# EasyEDA Pro project AT32M412_EVB_V0.3.eprj, board AT32M412_EVB_V0.2
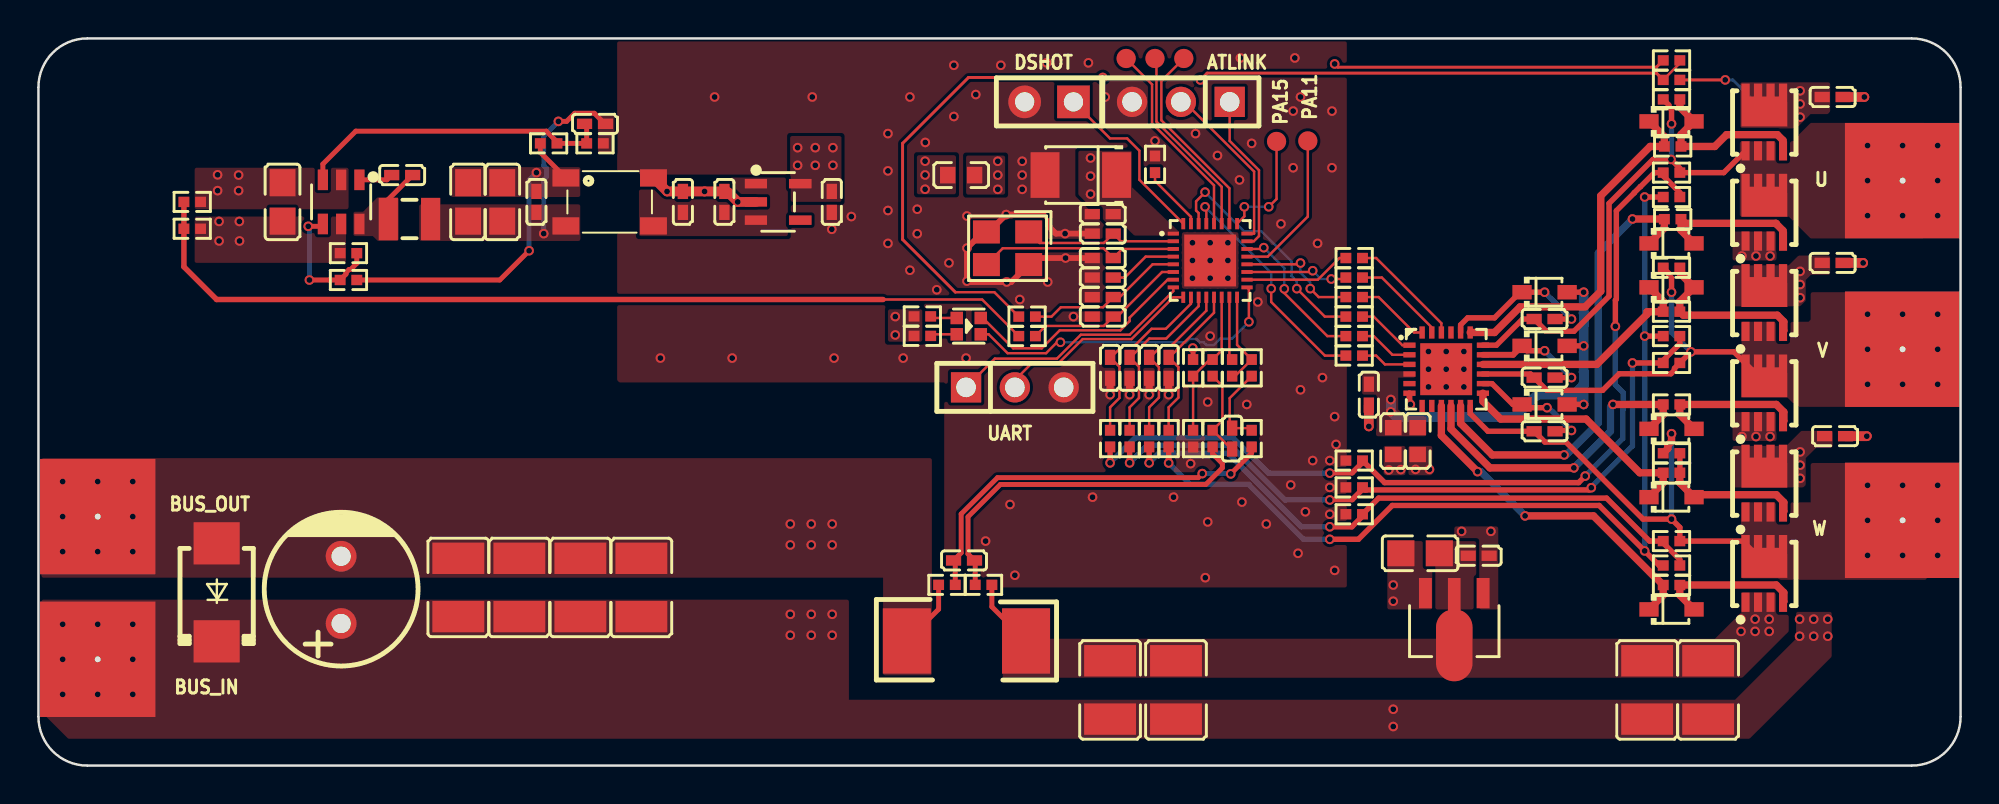
[diagram p4: board, top side]
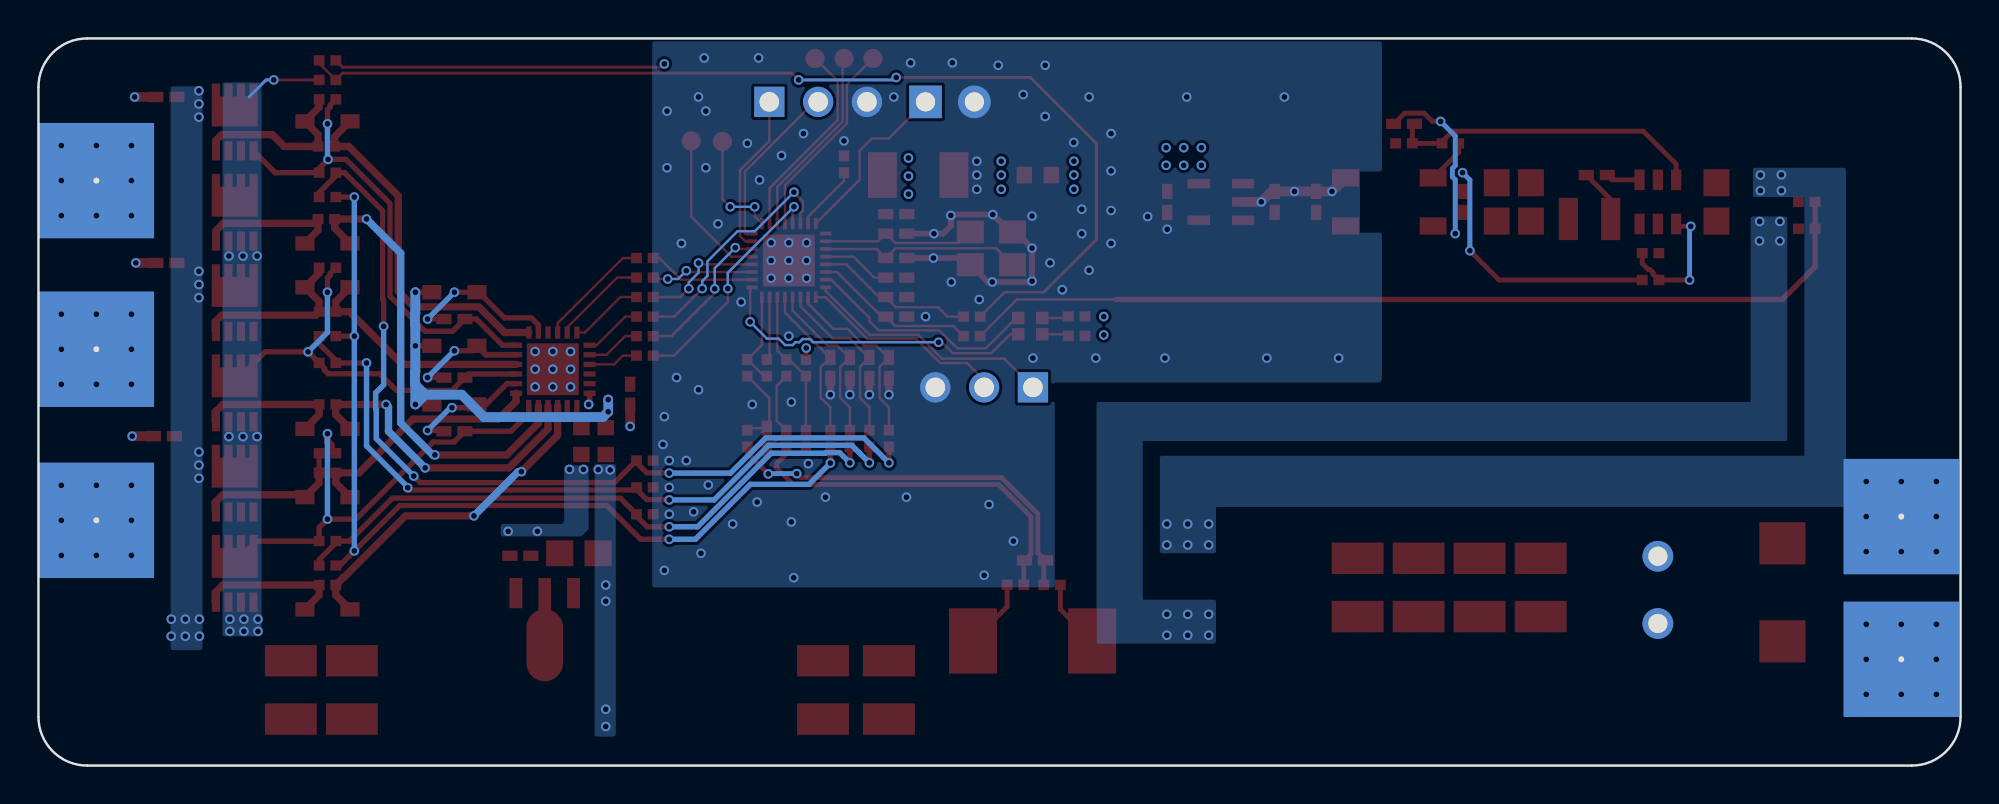
[diagram p5: board, bottom side, seen from below]

Outline 100 x 37.85 mm; copper layers: Top Layer, GND02, PWR03, Bottom Layer. Coordinates in mm from the lower left corner of the outline.
Outline path: 0,35.31 0,2.54 arc(0.74,0.74) 2.54,0 97.46,0 arc(99.26,0.74) 100,2.54 100,35.31 arc(99.26,37.1) 97.46,37.85 2.54,37.85 arc(0.74,37.1) 0,35.31
Stack: Top Layer 0.035mm 外层铜厚1oz / Dielectric1 0.2104mm 7628 RC49% 8.6mil / GND02 0.0152mm 内层铜厚 / Dielectric2 1.065mm 1.1mm H/HOZ Copper / PWR03 0.0152mm 内层铜厚 / Dielectric3 0.2104mm 7628 RC49% 8.6mil / Bottom Layer 0.035mm 外层铜厚1oz

## Design rules (mm)
template: 自定义配置
spacing copperThickness1oz (default): track to track 0.102, other pairs 0.152 to 0.3
spacing copperThickness2oz: track to track 0.203, other pairs 0.152 to 0.3
spacing edgeClearance: track to track 0.152, other pairs 0 to 0.152
track width copperThickness1oz (default): min 0.127, default 0.127, max 2.54
track width PWR: min 0.152, default 0.381, max 2.54
differential pair 90ohm (default): width min 0.152, default 0.152, max 0.152; gap min 0.178, default 0.178
via viaSize (default): diameter min 0.5, default 0.5, max 10; hole min 0.3, default 0.305, max 6.299
net GND uses PWR
net VBUS uses PWR
net GNDP uses PWR
net VCC_3V3 uses PWR
region e1533 uses edgeClearance
region e1534 uses edgeClearance
region e1535 uses edgeClearance
region e1536 uses edgeClearance
region e1537 uses edgeClearance

## Placement (name value [footprint] x y rotation side)
ATLINK  PM254V-11-03-H85  [HDR-TH_3P-P2.54-V-F]  59.44 34.54 180 top
BUS_IN  -  [PAD_35A]  4.35 5.02 180 top
BUS_OUT  -  [PAD_35A]  4.35 12.45 180 top
C131  100nF  [C0402]  55.37 28.7 0 top
C205  220uF  [CAP-TH_BD8.0-P3.50-D0.6-FD]  15.75 9.14 90 top
C208  10uF  [C0805]  12.7 29.34 270 top
C210  10uF  [C0402]  25.91 29.34 270 top
C211  100nF  [C0402]  55.37 25.4 0 top
C212  12pF  [C0402]  55.37 27.69 180 top
C213  12pF  [C0402]  55.37 26.42 0 top
C214  100nF  [C0402]  69.21 19.3 270 top
C215  100nF  [C0402]  78.36 23.24 0 top
C217  100nF  [C0402]  78.36 20.19 0 top
C219  100nF  [C0402]  78.36 17.4 0 top
C220  2.2nF  [C0402]  48.15 10.68 180 top
C221  4.7uF  [C1210]  59.18 3.94 270 top
C225  100nF  [C0402]  55.37 23.37 0 top
C226  100nF  [C0402]  55.37 24.38 0 top
C227  33pF  [C0402]  55.75 20.7 90 top
C228  33pF  [C0402]  56.77 20.7 90 top
C229  33pF  [C0402]  57.79 20.7 90 top
C230  33pF  [C0402]  58.8 20.7 90 top
C231  100pF  [C0402]  62.1 17.02 270 top
C232  100nF  [C0402]  18.92 30.73 180 top
C233  100nF  [C0402]  28.96 33.4 180 top
C234  10uF  [C0402]  33.53 29.34 270 top
C235  1uF  [C0402]  35.69 29.34 270 top
C236  1uF  [C0402]  41.27 29.34 90 top
C237  100uF  [CASE-B_3528]  54.23 30.73 180 top
C238  100nF  [C0402]  93.35 34.8 0 top
C239  100nF  [C0402]  93.35 26.16 0 top
C240  100nF  [C0402]  93.47 17.14 0 top
C241  100nF  [C0402]  74.93 10.92 180 top
C243  4.7uF  [C0805]  22.35 29.34 270 top
C244  4.7uF  [C0805]  24.13 29.34 270 top
C245  4.7uF  [C1210]  21.84 9.27 270 top
C246  4.7uF  [C1210]  25.02 9.27 270 top
C247  4.7uF  [C1210]  28.19 9.27 270 top
C248  4.7uF  [C1210]  31.37 9.27 270 top
C249  4.7uF  [C1210]  55.75 3.94 270 top
C250  4.7uF  [C1210]  83.69 3.94 270 top
C251  4.7uF  [C1210]  86.87 3.94 270 top
C252  330nF  [C0805]  71.88 11.05 180 top
D37  1N4148WS  [SOD-323_L1.8-W1.3-LS2.5-RD]  78.36 24.64 0 top
D38  1N4148WS  [SOD-323_L1.8-W1.3-LS2.5-RD]  78.36 21.84 0 top
D39  1N4148WS  [SOD-323_L1.8-W1.3-LS2.5-RD]  78.36 18.8 0 top
D40  1N4148WS  [SOD-323_L1.8-W1.3-LS2.5-RD]  84.96 33.53 0 top
D41  1N4148WS  [SOD-323_L1.8-W1.3-LS2.5-RD]  84.96 24.89 0 top
D42  1N4148WS  [SOD-323_L1.8-W1.3-LS2.5-RD]  84.96 13.97 0 top
D43  1N4148WS  [SOD-323_L1.8-W1.3-LS2.5-RD]  84.96 27.18 0 top
D44  1N4148WS  [SOD-323_L1.8-W1.3-LS2.5-RD]  84.96 17.53 0 top
D45  1N4148WS  [SOD-323_L1.8-W1.3-LS2.5-RD]  84.96 8.13 0 top
DSHOT  2.54-1*2P母  [HDR-TH_2P-P2.54-V-F]  52.58 34.54 180 top
L11  2.2uH  [IND-SMD_L2.5-W2.0_MHCHL2520]  19.3 28.45 0 top
L12  ACT45B-510-2P-TL003  [IND-SMD_4P-L4.5-W3.2-TL]  29.72 29.34 0 top
L13  BLM18AG102SN1D  [L0603]  48.01 30.73 0 top
L14  BLM18AG102SN1D  [L0603]  71.75 16.89 90 top
L15  NC  [L0603]  70.48 16.89 90 top
LDO1  ME6211C33M5G-N  [SOT-23-5_L3.0-W1.7-P0.95-LS2.8-BL]  38.48 29.34 270 top
LED1  NCD1615RG1  [LED-SMD_4P-L1.6-W1.5-TL-1]  48.4 22.87 180 top
PA11  -  [Mark-Point-1mm]  66.04 32.51 90 top
PA15  -  [Mark-Point-1mm]  64.41 32.48 90 top
PB3  -  [Mark-Point-1mm]  59.59 36.8 90 top
PB4  -  [Mark-Point-1mm]  58.09 36.8 90 top
PB5  -  [Mark-Point-1mm]  56.59 36.8 90 top
Q1  TMG60N04DF  [POWERDI3333-8_DMN7022LFGQ-7]  89.79 33.02 0 top
Q2  TMG60N04DF  [POWERDI3333-8_DMN7022LFGQ-7]  89.79 28.32 0 top
Q3  TMG60N04DF  [POWERDI3333-8_DMN7022LFGQ-7]  89.79 23.62 0 top
Q4  TMG60N04DF  [POWERDI3333-8_DMN7022LFGQ-7]  89.79 18.92 0 top
Q5  TMG60N04DF  [POWERDI3333-8_DMN7022LFGQ-7]  89.79 14.22 0 top
Q6  TMG60N04DF  [POWERDI3333-8_DMN7022LFGQ-7]  89.79 9.53 0 top
R186  124kΩ  [R0402]  28.96 32.39 180 top
R188  1kΩ  [R0402]  58.09 31.29 90 top
R189  1kΩ  [R0402]  45.99 23.38 0 top
R190  1kΩ  [R0402]  45.99 22.36 0 top
R191  10Ω  [R0402]  85.02 32.22 0 top
R192  10Ω  [R0402]  85.02 28.44 0 top
R193  10Ω  [R0402]  84.96 23.62 0 top
R194  10Ω  [R0402]  84.96 18.8 0 top
R195  10Ω  [R0402]  84.96 15.24 0 top
R196  10Ω  [R0402]  84.96 9.4 0 top
R197  10Ω  [R0402]  68.45 26.42 0 top
R198  10Ω  [R0402]  68.45 23.37 0 top
R199  10Ω  [R0402]  68.45 25.4 0 top
R200  10Ω  [R0402]  68.45 22.35 0 top
R201  10Ω  [R0402]  68.45 24.38 0 top
R202  10Ω  [R0402]  68.45 21.34 0 top
R203  2mΩ  [RES-SMD_L6.4-W3.2-1]  48.28 6.49 180 top
R204  10Ω  [R0402]  49.17 9.41 0 top
R205  10Ω  [R0402]  47.27 9.41 180 top
R206  NCP15XH103F03RC  [R0402]  84.96 35.69 180 top
R207  3kΩ  [R0402]  84.96 36.7 180 top
R208  100Ω  [R0402]  51.43 22.35 0 top
R209  100Ω  [R0402]  51.43 23.37 0 top
R211  51kΩ  [R0402]  84.96 29.59 0 top
R213  3kΩ  [R0402]  68.45 15.88 180 top
R214  43kΩ  [R0402]  84.96 30.86 0 top
R215  51kΩ  [R0402]  84.96 22.35 0 top
R216  43kΩ  [R0402]  84.96 20.95 0 top
R217  3kΩ  [R0402]  68.45 14.48 180 top
R218  51kΩ  [R0402]  84.96 10.41 0 top
R219  43kΩ  [R0402]  84.96 11.68 0 top
R220  3kΩ  [R0402]  68.45 13.08 180 top
R221  1Ω  [R0402]  55.75 17.02 90 top
R222  1Ω  [R0402]  56.77 17.02 90 top
R223  1Ω  [R0402]  57.79 17.02 90 top
R224  1Ω  [R0402]  58.8 17.02 90 top
R225  1.2kΩ  [R0402]  61.09 17.02 90 top
R226  1.2kΩ  [R0402]  63.12 17.02 90 top
R227  1.2kΩ  [R0402]  61.09 20.7 90 top
R228  1.2kΩ  [R0402]  63.12 20.7 90 top
R229  66.5kΩ  [R0402]  62.1 20.7 90 top
R230  47kΩ  [R0402]  8 27.94 180 top
R231  10kΩ  [R0402]  8 29.34 0 top
R237  133kΩ  [R0402]  60.07 20.7 270 top
R238  133kΩ  [R0402]  60.07 17.02 90 top
R239  200kΩ  [R0402]  84.96 34.67 0 top
R240  200kΩ  [R0402]  84.96 25.91 0 top
R241  200kΩ  [R0402]  84.96 16.26 0 top
R242  23.7kΩ  [R0402]  26.54 32.39 180 top
R243  12kΩ  [R0402]  16.13 26.67 0 top
R244  4.7kΩ  [R0402]  16.13 25.27 0 top
U  -  [PAD_35A]  95.72 30.95 0 top
U34  AT32M412KBU7-4  [WQFN-32_L4.0-W4.0-P0.40-TL-EP2.7]  60.96 26.29 0 top
U39  BL9342  [SOT-23-6_L2.9-W1.6-P0.95-LS2.8-BL]  15.75 29.34 180 top
U40  JSM6288Q  [VQFN-24_L4.0-W4.0-P0.50-TL-EP2.7]  73.24 20.63 0 top
U41  SMBJ18A  [SMB_L4.5-W3.6-LS5.4-RD]  9.27 9.02 90 top
U43  CJ78L12  [SOT-89-3_L4.5-W2.5-P1.50-LS4.2-BR]  73.66 7.62 90 top
UART  PM254V-11-03-H85  [HDR-TH_3P-P2.54-V-F]  50.8 19.69 0 top
V  -  [PAD_35A]  95.72 22.18 0 top
W  -  [PAD_35A]  95.72 13.27 0 top
X3  24MHz  [CRYSTAL-SMD_4P-L3.2-W2.5-BL]  50.42 26.92 180 top

## Footprints (pads in the part's own frame, mm; a bottom-side part is the same pattern mirrored in y, then rotated)
C0402
  rect 0.79x0.54 smd: 1(-0.545,0) 2(0.545,0)
C0805
  rect 1.41x1.35 smd: 1(-1,0) 2(1,0)
C1210
  rect 1.635x2.7 smd: 1(-1.518,0) 2(1.518,0)
CAP-TH_BD8.0-P3.50-D0.6-FD
  round 1.6 hole 1: 1(-1.75,0) 2(1.75,0)
CASE-B_3528
  rect 1.506x2.376 smd: 1(-1.861,0) 2(1.861,0)
CRYSTAL-SMD_4P-L3.2-W2.5-BL
  rect 1.4x1.2 smd: 1(-1.1,-0.85) 2(1.1,-0.85) 3(1.1,0.85) 4(-1.1,0.85)
HDR-TH_2P-P2.54-V-F
  rect 1.7x1.7 hole 1: 1(-1.27,0)
  round 1.7 hole 1: 2(1.27,0)
HDR-TH_3P-P2.54-V-F
  rect 1.575x1.575 hole 1.02: 1(-2.54,0)
  round 1.575 hole 1.02: 2(0,0) 3(2.54,0)
IND-SMD_4P-L4.5-W3.2-TL
  rect 1.4x0.9 smd: 1(-2.28,1.25) 2(-2.28,-1.25) 3(2.28,-1.25) 4(2.28,1.25)
IND-SMD_L2.5-W2.0_MHCHL2520
  rect 1x2.2 smd: 1(-1.1,0) 2(1.1,0)
L0603
  rect 0.8x0.864 smd: 1(-0.7,0) 2(0.7,0)
LED-SMD_4P-L1.6-W1.5-TL-1
  rect 0.65x0.65 smd: 1(-0.625,0.425) 2(0.625,0.425) 3(-0.625,-0.425) 4(0.625,-0.425)
Mark-Point-1mm
  round 1 smd: 1(0,0)
PAD_35A
  rect 6x6 hole 0.305: 1(1.27,-0.508)
POWERDI3333-8_DMN7022LFGQ-7
  rect 0.42x1 smd: 1(-0.975,-1.025) 2(-0.325,-1.025) 3(0.325,-1.025) 4(0.975,-1.025)
  custom 2.39x2.23 smd: 5(0.005,1.025)
R0402
  rect 0.566x0.54 smd: 1(-0.433,0) 2(0.433,0)
RES-SMD_L6.4-W3.2-1
  rect 2.5x3.4 smd: 1(-3.1,0) 2(3.1,0)
SMB_L4.5-W3.6-LS5.4-RD
  rect 2.2x2.4 smd: 1(-2.551,0) 2(2.551,0)
SOD-323_L1.8-W1.3-LS2.5-RD
  rect 1x0.75 smd: 1(-1.173,0) 2(1.173,0)
SOT-23-5_L3.0-W1.7-P0.95-LS2.8-BL
  rect 0.49x1.157 smd: 1(-0.95,-1.153) 2(0,-1.153) 3(0.95,-1.153)
  rect 0.49x1.175 smd: 4(0.95,1.153) 5(-0.95,1.153)
SOT-23-6_L2.9-W1.6-P0.95-LS2.8-BL
  rect 0.532x1.072 smd: 1(-0.95,-1.149) 2(0,-1.149) 3(0.95,-1.149) 4(0.95,1.149) 5(0,1.149) 6(-0.95,1.149)
SOT-89-3_L4.5-W2.5-P1.50-LS4.2-BR
  rect 1.575x0.672 smd: 1(1.356,-1.5) 3(1.356,1.5)
  custom 5.377x1.9 smd: 2(-1.356,0)
VQFN-24_L4.0-W4.0-P0.50-TL-EP2.7
  rect 0.633x0.28 smd: 1(-1.911,1.25) 2(-1.911,0.75) 3(-1.911,0.25) 4(-1.911,-0.25) 5(-1.911,-0.75) 6(-1.911,-1.25) 13(1.911,-1.25) 14(1.911,-0.75) 15(1.911,-0.25) 16(1.911,0.25) 17(1.911,0.75) 18(1.911,1.25)
  rect 0.28x0.633 smd: 7(-1.25,-1.911) 8(-0.75,-1.911) 9(-0.25,-1.911) 10(0.25,-1.911) 11(0.75,-1.911) 12(1.25,-1.911) 19(1.25,1.911) 20(0.75,1.911) 21(0.25,1.911) 22(-0.25,1.911) 23(-0.75,1.911) 24(-1.25,1.911)
  rect 2.7x2.7 smd: 25(0,0)
WQFN-32_L4.0-W4.0-P0.40-TL-EP2.7
  rect 0.585x0.2 smd: 1(-1.917,1.4) 2(-1.917,1) 3(-1.917,0.6) 4(-1.917,0.2) 5(-1.917,-0.2) 6(-1.917,-0.6) 7(-1.917,-1) 8(-1.917,-1.4) 17(1.917,-1.4) 18(1.917,-1) 19(1.917,-0.6) 20(1.917,-0.2) 21(1.917,0.2) 22(1.917,0.6) 23(1.917,1) 24(1.917,1.4)
  rect 0.2x0.585 smd: 9(-1.4,-1.917) 10(-1,-1.917) 11(-0.6,-1.917) 12(-0.2,-1.917) 13(0.2,-1.917) 14(0.6,-1.917) 15(1,-1.917) 16(1.4,-1.917) 25(1.4,1.917) 26(1,1.917) 27(0.6,1.917) 28(0.2,1.917) 29(-0.2,1.917) 30(-0.6,1.917) 31(-1,1.917) 32(-1.4,1.917)
  rect 2.7x2.7 smd: 33(0,0)

## Nets
As in the schematic.

Pads without a net: LDO1 4; U40 5 7 8 21

## Via types
v1: diameter 0.5, hole 0.305, Top Layer to Bottom Layer, 290 vias

## Routing (per net, layer and track width the routed paths; a pad name or vN(x,y) marks a point on that pad's centre or on a via; arc(x,y) is an arc through that point)
GND: length 26
  Top Layer w0.305: C212.2 v1(53.41,27.69) 52.94,27.69 52.53,28.09 v1(52.53,28.63) 52.48,28.68 v1(50.35,28.68) 49.44,27.77 X3.2 49.15,27.77 v1(48.31,26.93) v1(48.31,25.22) 48.35,25.17 50.61,25.17 X3.4 51.86,26.42 v1(53.44,26.42) C213.1
  Top Layer w0.381: C229.1 v1(57.79,19.3) ; C228.1 v1(56.77,19.3) ; C230.1 v1(58.8,19.3) ; C227.1 v1(55.75,19.3)
  Top Layer w0.508: LDO1.2 v1(36.38,29.34) 35.87,29.84 35.72,29.84 C235.1 v1(34.66,29.88) C234.1 v1(32.7,29.88) L12.4
  vias: v1(32.36,21.21) v1(35.18,34.8) v1(36.09,21.21) v1(40.26,34.8) v1(41.27,27.91) v1(41.39,21.21) v1(42.29,28.58) v1(44.2,32.89) v1(44.2,30.95) v1(44.2,28.89) v1(44.2,27.18) v1(44.99,21.21) v1(45.34,34.8) v1(45.34,25.78) v1(45.72,28.96) v1(45.72,27.68) v1(46.14,32.43) v1(46.74,24.77) v1(47.37,26.16) v1(47.63,36.45) v1(47.63,33.78) v1(48.26,21.21) v1(48.31,28.6) v1(48.77,34.92) v1(49.28,11.68) v1(50.07,36.45) v1(50.38,25.17) v1(50.55,13.59) v1(50.8,9.91) v1(51.05,24.26) v1(51.18,31.45) v1(51.18,30.73) v1(51.18,29.99) v1(52.45,36.58) v1(52.51,25.17) v1(53.85,23.37) v1(54.63,36.58) v1(54.84,13.97) v1(55.5,34.8) v1(58.09,32.51) v1(59.05,13.97) v1(59.94,15.71) v1(60.04,27.21) v1(60.04,26.29) v1(60.04,25.37) v1(60.2,32.89) v1(60.71,9.78) v1(60.83,18.92) v1(60.83,12.68) v1(60.96,27.21) v1(60.96,26.29) v1(60.96,25.37) v1(60.96,22.35) v1(61.34,31.75) v1(61.88,27.21) v1(61.88,26.29) v1(61.88,25.37) v1(62.48,30.48) v1(62.53,36.83) v1(62.61,13.72) v1(62.86,18.8) v1(63.12,32.39) v1(63.44,24.13) v1(63.88,12.57) v1(64.64,28.19) v1(65.15,14.61) v1(65.28,34.07) v1(65.28,31.11) v1(65.36,36.83) v1(65.53,11.05) v1(65.66,34.8) v1(65.66,19.56) v1(65.91,13.21) v1(66.29,15.88) v1(66.55,27.18) v1(66.8,20.19) v1(67.18,15.88) v1(67.18,14.48) v1(67.18,13.08) v1(67.3,34.07) v1(67.3,31.11) v1(67.44,18.16) v1(67.44,10.16) v1(67.51,16.72)
GND_IN: length 19.8
  Top Layer w0.254: v1(25.53,26.8) 24,25.27 R244.2 ; L12.1 26.11,31.92 R242.2 ; 46.83,9.41 46.83,8.14 R203.2
  Bottom Layer w0.254: v1(25.91,30.86) 25.53,30.48 v1(25.53,26.8)
  vias: v1(1.26,14.78) v1(1.26,12.96) v1(1.26,11.14) v1(3.08,14.78) v1(3.08,11.14) v1(4.91,14.78) v1(4.91,12.96) v1(4.91,11.14) v1(9.32,30.75) v1(9.32,29.92) v1(10.41,30.73) v1(10.41,29.92) v1(39.12,12.57) v1(39.12,11.48) v1(40.21,12.57) v1(40.21,11.48) v1(41.3,12.57) v1(41.3,11.48)
GNDP: length 12.7
  Top Layer w0.152: R206.1 v1(87.76,35.69)
  Top Layer w0.254: R204.2 49.6,8.26 R203.1
  Top Layer w0.305: U40.6 71.33,18.84 v1(71.37,18.8)
  Top Layer w0.508: C240.2 v1(95.12,17.14) ; C214.2 v1(69.21,17.65) ; 93.83,26.16 v1(94.93,26.16) ; C238.2 v1(95,34.8)
  Bottom Layer w0.152: v1(87.76,35.69) 88.16,35.69 89.04,34.8
  vias: v1(72.32,21.55) v1(72.32,20.63) v1(72.32,19.71) v1(73.24,21.55) v1(73.24,20.63) v1(73.24,19.71) v1(74.16,21.55) v1(74.16,20.63) v1(74.16,19.71) v1(88.58,7.62) v1(88.58,6.98) v1(88.63,26.52) v1(88.63,17.12) v1(89.36,26.52) v1(89.36,17.12) v1(89.31,7.62) v1(89.31,6.98) v1(90.04,7.62) v1(90.04,6.98) v1(90.09,26.52) v1(90.09,17.12)
VBUS:
  vias: v1(1.26,7.35) v1(1.26,5.53) v1(1.26,3.71) v1(3.08,7.35) v1(3.08,3.71) v1(4.91,7.35) v1(4.91,5.53) v1(4.91,3.71) v1(9.4,28.32) v1(9.4,27.31) v1(10.45,28.32) v1(10.46,27.31) v1(39.12,7.87) v1(39.12,6.78) v1(40.21,7.87) v1(40.21,6.78) v1(41.3,7.87) v1(41.3,6.78) v1(70.25,15.39) v1(70.48,9.4) v1(70.48,8.55) v1(70.48,2.93) v1(70.48,2.03) v1(70.88,15.41) v1(91.65,35.12) v1(91.65,34.43) v1(91.65,33.75) v1(91.65,25.72) v1(91.65,25.04) v1(91.65,24.35) v1(91.65,16.32) v1(91.65,15.64) v1(91.65,14.95) v1(91.63,7.62) v1(91.63,6.73) v1(92.36,7.62) v1(92.36,6.73) v1(93.09,7.62) v1(93.09,6.73)
VBUS_REF: length 48.3
  Top Layer w0.127: R208.1 49.1,24.26 43.94,24.26
  Top Layer w0.28: R231.1 R230.2 7.57,25.96 9.27,24.26 43.94,24.26
VCC_3V3:
  vias: v1(39.5,32.16) v1(39.5,31.24) v1(40.42,32.16) v1(40.42,31.24) v1(41.33,32.16) v1(41.33,31.24) v1(46.13,31.46) v1(46.13,30.74) v1(46.13,30)
VCC_5V: length 9.1
  Top Layer w0.254: v1(27.05,33.53) 27.48,33.53 27.9,33.95 28.92,33.95 29.34,33.53 29.37,33.53 C233.1
  Bottom Layer w0.254: v1(26.29,27.69) 26.29,30.49 26.44,30.64 26.44,31.08 26.29,31.23 26.29,32.77 v1(27.05,33.53)
VCC_12V:
  vias: v1(71.65,15.42) v1(72.37,15.42) v1(74.04,12.19) v1(75.57,12.19)
VDD_3V3: length 17.9
  Top Layer w0.152: v1(67.44,36.52) 67.61,36.35 84.18,36.35 R207.2
  Top Layer w0.254: v1(60.06,21.73) 60.07,21.72 R237.1
  vias: v1(44.58,23.37) v1(44.58,22.41) v1(49.91,31.45) v1(49.91,30.73) v1(49.91,29.99) v1(54.74,31.62) v1(54.74,30.68) v1(54.74,29.74)
BOOT0: length 3.4
  Top Layer w0.127: U34.31 59.96,28.56 58.09,30.43 R188.1
COM_NUTRAL: length 50.6
  Top Layer w0.28: v1(67.18,11.78) 68.67,11.78 70.43,13.54 81.2,13.54 v1(83.57,11.17) 84.32,10.41 R218.1 ; R211.1 v1(83.57,29.59) ; R224.1 v1(58.8,15.75) ; R215.1 v1(83.57,22.35)
  Bottom Layer w0.28: v1(58.8,15.75) 59.91,14.64 62.96,14.64 65.82,11.78 v1(67.18,11.78) ; v1(83.57,22.35) v1(83.57,29.59) ; v1(83.57,11.17) 83.57,22.35
EMF1: length 47.5
  Top Layer w0.28: v1(82.04,22.86) 82.04,24.22 82.09,24.27 82.09,28.88 83.02,29.81 83.02,29.82 83.34,30.13 83.35,30.13 84.08,30.86 R214.1 84.53,30.69 85.4,29.82 R211.2 ; v1(80.47,15.07) 80.13,14.73 70.03,14.73 68.89,15.88 68.89,15.77 68.35,15.24 67.18,15.24 ; 55.75,16.59 v1(55.75,15.76)
  Bottom Layer w0.28: v1(67.18,15.22) 63.99,15.22 62.16,17.05 57.05,17.05 v1(55.75,15.76) ; v1(82.04,22.86) 82.04,19.81 82.46,19.4 82.46,18.57 82.42,18.54 82.42,17.02 v1(80.47,15.07)
EMF2: length 37.6
  Top Layer w0.28: R215.2 85.4,21.96 84.46,21.02 R216.1 v1(82.93,20.95) ; 67.18,13.84 68.35,13.84 68.89,14.38 68.89,14.48 69.02,14.35 80.67,14.35 v1(80.79,14.46) ; 56.77,16.59 v1(56.77,15.76)
  Bottom Layer w0.28: v1(80.79,14.46) 80.79,14.5 82.93,16.64 v1(82.93,20.95) ; v1(56.77,15.76) 57.68,16.67 62,16.67 64.85,13.83 v1(67.18,13.83)
EMF3: length 32.6
  Top Layer w0.28: v1(67.18,12.43) 68.33,12.43 68.89,12.98 68.89,13.08 69.72,13.92 81.58,13.92 83.82,11.68 R219.1 84.53,11.58 85.4,10.72 R218.2 ; 57.79,16.59 v1(57.79,15.76)
  Bottom Layer w0.28: v1(57.79,15.76) 58.32,16.29 59.03,16.29 59.06,16.26 61.88,16.26 65.71,12.43 v1(67.18,12.43)
EMF_NUTRAL: length 8.3
  Top Layer w0.127: U34.13 61.16,23.57 58.84,21.25 C230.2 59.31,20.74 59.31,19.15 58.8,18.64 R224.2
EMF_U: length 9.9
  Top Layer w0.127: U34.10 59.96,24.04 58.65,22.73 57.91,22.73 57.04,21.86 56.41,21.86 55.8,21.25 C227.2 56.24,20.76 56.24,19.13 55.75,18.64 R221.2
EMF_V: length 9.4
  Top Layer w0.127: R222.2 56.77,18.64 57.26,19.13 57.26,20.76 C228.2 56.81,21.25 57.79,22.22 58.67,22.22 60.36,23.91 U34.11
EMF_W: length 8.9
  Top Layer w0.127: R223.2 57.79,18.64 58.29,19.15 58.29,20.74 C229.2 57.83,21.25 58.44,21.86 58.94,21.86 60.76,23.68 U34.12
FB: length 16.7
  Top Layer w0.254: C233.2 28.52,33.29 R186.2 26.98,32.39 27.02,32.43 26.42,33.02 16.51,33.02 14.8,31.31 U39.3
HO1: length 18.7
  Top Layer w0.381: U40.19 75.75,22.54 77.09,23.88 80.47,23.88 81.28,24.69 81.28,29.65 83.85,32.22 R191.1 84.59,32.73 D40.1
HO2: length 12.2
  Top Layer w0.381: D41.1 84.53,24.15 R193.1 83.69,23.62 83.69,23.5 81.08,20.88 U40.16
HO3: length 12.9
  Top Layer w0.381: U40.13 75.15,18.96 76.07,18.03 80.52,18.03 83.31,15.24 R195.1 84.53,14.71 D42.1
I_BUS_GND: length 20.6
  Top Layer w0.254: v1(62.03,15.18) 63.12,16.27 R226.1 ; v1(60.55,15.2) 60.34,14.99 49.9,14.99 48.01,13.1 48.01,11.07 C220.2 47.7,10.59 R205.1
  Bottom Layer w0.254: v1(62.03,15.18) 62.02,15.2 v1(60.55,15.2)
I_BUS_SHUNT: length 19.3
  Top Layer w0.254: R225.1 61.09,16.23 61.6,15.72 61.6,15.49 60.73,14.63 50.04,14.63 48.36,12.95 48.36,11.01 C220.1 48.74,10.64 R204.1
LED_G: length 17.1
  Top Layer w0.127: v1(62.98,23.1) 62.98,24.79 U34.17 ; v1(53.17,22.03) 52.99,22.03 52.42,21.46 50.42,21.46 49.44,22.45 LED1.1
  Bottom Layer w0.127: v1(53.17,22.03) 59.7,22.03 59.86,22.2 60.25,22.2 60.42,22.03 60.62,22.03 60.77,21.89 61.15,21.89 61.49,22.22 62.1,22.22 v1(62.98,23.1)
LED_R: length 12.3
  Top Layer w0.127: LED1.3 49.13,23.3 50.71,21.72 52.2,21.72 53.13,22.65 56.29,22.65 56.77,23.13 56.77,23.31 58.74,25.29 U34.7
LO1: length 24
  Top Layer w0.381: v1(82.93,28.45) 84.58,28.45 R192.1 84.59,27.98 D43.1 ; U40.11 73.99,17.81 75.64,16.17 v1(79.37,16.17)
  Bottom Layer w0.381: v1(79.37,16.17) 79.49,16.17 81.15,17.83 81.15,26.67 v1(82.93,28.45)
LO2: length 16.8
  Top Layer w0.381: U40.10 73.49,17.52 75.52,15.49 v1(79.88,15.49) ; D44.1 84.53,18.27 R194.1 v1(81.92,18.8)
  Bottom Layer w0.381: v1(81.92,18.8) 81.79,18.67 81.79,17.4 v1(79.88,15.49)
LO3: length 17.9
  Top Layer w0.381: v1(74.87,15.3) 72.99,17.18 U40.9 ; v1(77.34,13) 80.9,13 84.1,9.8 84.13,9.8 R196.1 84.53,8.87 D45.1
  Bottom Layer w0.381: v1(74.87,15.3) 75.04,15.3 v1(77.34,13)
MOS_NTC: length 55.4
  Top Layer w0.127: R206.2 85.4,36.55 R207.1 ; R209.1 49.73,24.64 47.7,24.64
  Top Layer w0.152: R206.2 84.18,36.04 60.8,36.04 v1(60.45,35.69) ; v1(55.37,35.81) 48.39,35.81 44.96,32.39 44.96,27.38 47.7,24.64
  Bottom Layer w0.152: v1(60.45,35.69) 55.5,35.69 v1(55.37,35.81)
MOS_TEMP: length 8.3
  Top Layer w0.127: R209.2 52.7,23.37 53.19,23.85 55.39,23.85 C226.2 56.26,24.38 57.97,26.09 U34.5
NRST: length 3.6
  Top Layer w0.127: C211.2 56.52,25.4 57.6,26.49 U34.4
OP3_INM_BUS: length 4.9
  Top Layer w0.127: R229.1 62.25,20.27 R228.2 62.36,21.89 U34.16
OP3_INP_BUS: length 7.6
  Top Layer w0.127: U34.14 61.56,21.61 R227.2 60.94,21.13 R237.2 R238.2
OP3_OUT_BUS: length 3.3
  Top Layer w0.127: U34.15 61.96,21.28 R229.2
OSC_IN: length 8
  Top Layer w0.127: 55.85,27.62 55.43,27.2 52.09,27.2 X3.1 ; U34.2 56.31,27.29 C212.1
OSC_OUT: length 10.4
  Top Layer w0.127: 55.85,26.48 55.41,26.92 50.17,26.92 X3.3 ; C213.2 56.39,26.89 U34.3
OUT1: length 25.2
  Top Layer w0.28: 88.81,32 87.68,30.86 R214.2 85.4,31.09 v1(84.93,31.55) 84,31.55 81.71,29.26 81.71,24.43 79.89,22.61 78.45,22.61 C215.1 77.22,23.24 75.85,21.88 U40.18 ; R239.1 84.82,34.38 84.82,34.28 84.96,34.14 v1(84.96,33.4)
  Bottom Layer w0.28: v1(84.93,31.55) 84.96,31.58 v1(84.96,33.4)
  vias: v1(95.16,32.27) v1(95.16,30.45) v1(95.16,28.62) v1(96.99,32.27) v1(96.99,28.62) v1(98.81,32.27) v1(98.81,30.45) v1(98.81,28.62)
OUT2: length 21.5
  Top Layer w0.28: U40.15 77.63,20.38 C217.1 78.48,19.53 81.38,19.53 82.24,20.39 84.93,20.39 85.12,20.58 85.12,20.68 R216.2 v1(85.97,21.53) 88.21,21.53 Q4.5 ; R240.1 84.82,25.62 84.82,25.52 84.96,25.38 v1(84.96,24.64)
  Bottom Layer w0.28: v1(85.97,21.53) 84.96,22.54 v1(84.96,24.64)
  vias: v1(95.16,23.49) v1(95.16,21.67) v1(95.16,19.84) v1(96.99,23.49) v1(96.99,19.84) v1(98.81,23.49) v1(98.81,21.67) v1(98.81,19.84)
OUT3: length 25
  Top Layer w0.28: U40.12 74.49,18.32 75.41,17.4 C219.1 78.38,16.84 79.47,16.84 83.48,12.83 v1(84.96,12.83) 85.4,12.39 R219.2 88.66,11.68 Q6.5
  Top Layer w0.381: R241.1 84.77,16.5 84.77,16.67 84.96,16.86 v1(84.96,17.27)
  Bottom Layer w0.28: v1(84.96,17.27) v1(84.96,12.83)
  vias: v1(95.16,14.59) v1(95.16,12.76) v1(95.16,10.94) v1(96.99,14.59) v1(96.99,10.94) v1(98.81,14.59) v1(98.81,12.76) v1(98.81,10.94)
PWM_IN_DSHOT: length 9.2
  Top Layer w0.127: DSHOT.1 55.75,32.64 56.64,32.64 57.28,32 57.28,30.49 U34.32
SWCLK: length 8.9
  Top Layer w0.127: ATLINK.2 59.62,34.54 63.25,30.92 63.25,27.69 U34.24
SWDIO: length 8.4
  Top Layer w0.127: ATLINK.1 61.98,32.51 63.5,30.99 63.5,27.56 63.23,27.29 U34.23
TIM1_CH1: length 5.6
  Top Layer w0.127: R197.1 67.69,26.42 66.56,25.29 U34.18
TIM1_CH1N: length 12.6
  Top Layer w0.127: v1(65.47,24.82) 66.92,23.37 R198.1 ; v1(60.69,29.84) 60.69,29.83 60.23,29.37 60.23,28.89 60.36,28.76 U34.30
  Bottom Layer w0.127: v1(65.47,24.82) 65.47,25.21 65.19,25.48 65.19,26.25 63.63,27.81 62.73,27.81 v1(60.69,29.84)
TIM1_CH2: length 5.4
  Top Layer w0.127: U34.19 66.23,25.69 v1(66.29,25.75) ; R199.1 67.94,25.32 v1(67.26,25.32)
  Bottom Layer w0.127: v1(67.26,25.32) 66.72,25.32 v1(66.29,25.75)
TIM1_CH2N: length 7.8
  Top Layer w0.127: v1(64.82,24.81) 64.82,24.59 67.06,22.35 R200.1 ; v1(63.75,26.95) 63.68,26.89 U34.22
  Bottom Layer w0.127: v1(63.75,26.95) 64.82,25.89 v1(64.82,24.81)
TIM1_CH3: length 6.4
  Top Layer w0.127: U34.20 65.59,26.09 v1(65.66,26.16) ; R201.1 66.61,24.38 v1(66.17,24.82)
  Bottom Layer w0.127: v1(66.17,24.82) 66.17,25.15 65.66,25.65 v1(65.66,26.16)
TIM1_CH3N: length 12.3
  Top Layer w0.127: R202.1 66.93,21.34 64.14,24.13 v1(64.14,24.82) ; v1(60.69,29.08) 60.76,29.02 U34.29
  Bottom Layer w0.127: v1(64.14,24.82) 64.14,25.64 v1(60.69,29.08)
UART_RX: length 10.9
  Top Layer w0.127: U34.9 59.04,24.37 56.87,22.2 54.33,22.2 53.08,20.95 51.69,20.95 50.8,20.06 UART.2
UART_TX: length 13.1
  Top Layer w0.127: UART.1 49.76,21.18 52.99,21.18 54.23,22.42 56.77,22.42 59.04,24.69 U34.8
V_BUS_FB: length 8.6
  Top Layer w0.127: U34.6 58.45,25.69 56.13,23.37 C225.2 55.43,22.88 52.4,22.88 R208.2
VB1: length 8.3
  Top Layer w0.28: v1(78.36,24.64) D37.1 77.09,24.64 75.75,23.3 74.36,23.3 73.99,22.94 U40.20 ; C215.2 v1(79.76,23.24)
  Bottom Layer w0.28: v1(79.76,23.24) v1(78.36,24.64)
VB2: length 6.3
  Top Layer w0.28: v1(78.36,21.59) 77.44,21.59 D38.1 ; C217.2 v1(79.76,20.19)
  Top Layer w0.305: U40.17 76.72,21.38 D38.1
  Bottom Layer w0.28: v1(79.76,20.19) v1(78.36,21.59)
VB3: length 6.5
  Top Layer w0.28: U40.14 75.62,19.88 76.71,18.8 D39.1 77.36,18.63 v1(78.49,18.63) ; C219.2 78.95,17.44 v1(79.76,17.44)
  Bottom Layer w0.28: v1(79.76,17.44) 78.57,18.63 v1(78.49,18.63)
VBOOST: length 20.6
  Top Layer w0.28: D39.2 v1(80.39,18.8) ; D37.2 v1(80.39,24.64) ; D38.2 v1(80.39,21.84)
  Bottom Layer w0.508: 79.88,19.3 80.39,19.81 ; 79.88,19.3 77.98,19.3 76.81,18.14 70.63,18.14 v1(70.36,18.42) v1(70.36,19.05) ; 79.88,19.3 v1(80.39,18.8) 80.39,19.81 ; 80.39,19.81 80.39,19.9 80.41,19.92 80.41,20.47 80.39,20.49 v1(80.39,21.84) 80.39,22.95 80.41,22.97 80.41,23.51 80.39,23.53 v1(80.39,24.64)
$1N15952: length 7
  Top Layer w0.254: v1(14.04,28.07) 14.68,28.07 U39.4 ; R243.2 16.56,26.14 16.25,25.82 16.16,25.82 16,25.66 16,25.58 R244.1 v1(14.1,25.27)
  Bottom Layer w0.254: v1(14.04,28.07) 14.1,28.01 v1(14.1,25.27)
$1N16158: length 1.8
  Top Layer w0.254: U39.1 18.13,30.49 C232.2
$1N16164: length 2.8
  Top Layer w0.254: C232.1 18.2,29.47 L11.1
$2N17344: length 8
  Top Layer w0.127: U34.21 63.95,26.49 66.04,28.58 PA11.1
$2N17781: length 5.9
  Top Layer w0.127: U34.25 62.74,28.58 v1(62.74,29.08) ; PA15.1 64.41,29.49 v1(64.01,29.08)
  Bottom Layer w0.127: v1(62.74,29.08) v1(64.01,29.08)
$2N18473: length 1.4
  Top Layer w0.127: 46.42,23.38 46.5,23.3 LED1.4
$2N18489: length 1.4
  Top Layer w0.127: 46.42,22.36 46.5,22.45 LED1.2
$2N29618: length 10.5
  Top Layer w0.127: PB5.1 57.94,35.45 57.94,33.42 61.16,30.2 U34.28
$2N29622: length 10
  Top Layer w0.127: PB4.1 58.17,36.72 58.17,33.52 61.56,30.12 U34.27
$2N29627: length 10.5
  Top Layer w0.127: U34.26 61.96,30.05 58.42,33.59 58.42,35.63 PB3.1
$9N2585: length 6
  Top Layer w0.127: U40.22 72.99,23.02 69.6,26.42 68.89,26.42
$9N2628: length 3.1
  Top Layer w0.127: 68.89,23.37 69.47,23.37 70.96,21.88 U40.1
$9N2671: length 5
  Top Layer w0.127: U40.23 72.52,22.57 72.52,22.78 69.89,25.4 68.89,25.4
$9N2714: length 2.8
  Top Layer w0.127: 68.89,22.35 69.47,22.35 70.44,21.38 U40.2
$9N2757: length 3.9
  Top Layer w0.127: U40.24 71.57,22.54 69.72,24.38 68.89,24.38
$9N2800: length 2.6
  Top Layer w0.127: 68.89,21.34 69.6,21.34 70.05,20.88 U40.3
$9N19403: length 9
  Top Layer w0.381: R240.2 85.4,25.63 D41.2 85.4,24.15 R193.2 85.58,23.44 90.47,23.44 90.8,23.1 90.8,22.64 Q3.4
$9N19423: length 8.1
  Top Layer w0.28: R195.2 R241.2
  Top Layer w0.381: 86.01,14.1 D42.2 ; 86.01,14.1 90.41,14.1 90.8,13.7 90.8,13.24 Q5.4 ; 86.01,14.1 85.4,14.71 R195.2
$9N19478: length 7.7
  Top Layer w0.381: Q2.4 90.76,27.84 90.42,28.18 90.42,28.19 90.39,28.22 85.67,28.22 R192.2 85.45,27.86 D43.2
$9N19572: length 7.7
  Top Layer w0.381: Q6.4 90.8,8.54 90.8,9 90.41,9.4 R196.2 85.4,8.87 D45.2
$9N19590: length 7.7
  Top Layer w0.381: Q4.4 90.8,17.94 90.8,18.4 90.41,18.8 R194.2 85.4,18.27 D44.2
$9N21132: length 9.3
  Top Layer w0.381: 90.76,32 90.76,32.54 90.47,32.84 87.83,32.84 87.21,32.22 R191.2 85.45,32.85 D40.2 85.4,34.27 R239.2
$10N1086: length 4.3
  Top Layer w0.127: R226.2 63.01,17.56 C231.1 61.98,17.69 61.98,19.12 R228.1
$10N1091: length 4.7
  Top Layer w0.127: R227.1 61.6,19.76 61.6,17.96 R225.2 62.07,16.47 C231.2

## Copper pours and planes (outline as drawn; the poured copper is in the pictures)
GND on Top Layer: 30.11,37.85 30.11,20.06 30.23,19.94 47.12,19.94 47.12,9.27 68.07,9.27 68.07,37.72 67.95,37.85
GND on Bottom Layer: 30.11,37.85 30.11,20.06 30.23,19.94 47.12,19.94 47.12,9.27 68.07,9.27 68.07,37.72 67.95,37.85
GND on GND02: 30.11,37.69 68.07,37.69 68.07,9.29 30.11,9.29
GND_IN on Top Layer: 8.13,31.11 16.14,31.11 16.14,28.96 8.13,28.96
GND_IN on Top Layer: 21.45,31.15 28.19,31.15 28.19,29.59 21.45,29.59
GND_IN on Top Layer: 43.94,9.78 0,9.78 0,16 46.48,16 46.48,4.7 43.94,4.7
GND_IN on Bottom Layer: 10.8,31.11 5.97,31.11 5.97,13.46 38.73,13.46 38.73,11.05 41.66,11.05 41.66,16.13 8.13,16.13 8.13,29.59 10.8,29.59
GND_IN on GND02: 0.16,37.69 46.36,37.69 46.36,0.16 0.16,0.16
GND_IN on PWR03: 0.16,37.69 46.36,37.69 46.36,0.16 0.16,0.16
GNDP on Top Layer: 88.14,27.8 90.42,27.8 90.42,26.29 88.14,26.29
GNDP on Top Layer: 86.18,6.6 50.17,6.6 50.17,4.57 88.65,4.57 91.06,6.98 91.06,9.02 88.62,9.02 88.6,9 88.6,7.98 87.22,6.6 86.18,6.6
GNDP on Top Layer: 72.26,11.68 74.8,11.68 74.8,8.13 72.26,8.13
GNDP on Top Layer: 88.14,18.4 90.42,18.4 90.42,16.89 88.14,16.89
GNDP on Bottom Layer: 88.39,6.73 90.42,6.73 90.42,35.56 88.39,35.56
GNDP on GND02: 47.12,37.69 99.85,37.69 99.85,0.16 47.12,0.16
GNDP on PWR03: 47.12,37.69 99.85,37.69 99.85,0.16 47.12,0.16
VBUS on Top Layer: 70.18,11.69 72.52,11.69 72.52,8.13 70.18,8.13
VBUS on Top Layer: 88.14,26.03 91.06,26.03 91.57,26.54 93.22,26.54 93.22,25.54 92.22,25.54 91.95,25.27 91.95,24.2 91.65,23.9 88.14,23.9
VBUS on Top Layer: 88.14,16.64 90.93,16.64 91.71,17.42 93.35,17.42 93.35,16.54 92.49,16.54 91.95,16 91.95,14.61 91.82,14.48 88.14,14.48
VBUS on Top Layer: 88.54,33.16 88.54,35.56 93.22,35.56 93.22,34.04 93.09,33.91 92.2,33.91 91.46,33.16
VBUS on Top Layer: 8.13,28.58 16,28.58 16,26.16 8.13,26.16
VBUS on Top Layer: 0,8.64 42.16,8.64 42.16,3.43 88.27,3.43 91.44,6.6 91.44,8 93.3,8 93.3,5.67 89.03,1.4 1.55,1.4 0,2.94
VBUS on Top Layer: 69.98,16.64 71.12,16.64 71.12,15.11 69.98,15.11
VBUS on Bottom Layer: 38.73,8.64 42.55,8.64 42.55,16.89 9.02,16.89 9.02,28.58 10.92,28.58 10.92,18.92 44.96,18.92 44.96,6.35 38.73,6.35
VBUS on Bottom Layer: 91.47,6.02 93.12,6.02 93.12,35.35 91.47,35.35
VBUS on Bottom Layer: 69.97,15.69 71.06,15.69 71.06,1.51 69.97,1.51
VCC_3V3 on Top Layer: 39.11,32.77 41.78,32.77 41.78,29.34 39.11,29.34
VCC_3V3 on Top Layer: 47.74,29.73 45.7,29.73 45.7,31.77 47.74,31.77
VCC_3V3 on PWR03: 39.1,32.77 46.61,32.77 46.61,29.59 39.1,29.59
VCC_5V on Top Layer: 19.81,29.21 28.19,29.21 28.19,27.31 19.81,27.31
VCC_5V on Top Layer: 29.11,33.85 29.97,33.85 29.97,31.88 29.11,31.88
VCC_12V on Top Layer: 74.8,8.13 75.95,8.13 75.95,12.45 73.66,12.45 73.66,11.78 74.8,11.78
VCC_12V on Top Layer: 71.25,16.64 72.52,16.64 72.52,15.11 71.25,15.11
VCC_12V on Bottom Layer: 71.37,15.62 71.37,12.31 71.76,11.93 75.93,11.93 75.95,11.94 75.95,12.57 72.77,12.57 72.64,12.7 72.64,15.62
VDD_3V3 on Top Layer: 56.9,30.1 59.33,27.79 59.33,27.59 57.01,27.59 56.39,28.2 55.61,28.2 54.1,29.71 54.1,32 56.9,32
VDD_3V3 on Top Layer: 48.26,31.75 50.29,31.75 50.29,29.72 48.26,29.72
VDD_3V3 on Top Layer: 44.2,23.75 45.99,23.75 45.99,22.06 44.2,22.06
VDD_3V3 on PWR03: 30.11,37.69 68.07,37.69 68.07,9.29 30.11,9.29
OUT1 on Top Layer: 91.07,28.57 92.2,27.43 98.04,27.43 98.17,27.56 98.17,33.45 92.2,33.45 91.25,32.5 88.52,32.5 88.52,28.57
OUT2 on Top Layer: 92.2,24.64 98.17,24.64 98.17,18.67 91.48,18.67 90.98,19.17 88.6,19.17 88.6,19.17 88.6,23.1 92.09,23.1 92.2,23.21
OUT3 on Top Layer: 88.58,13.7 88.58,9.67 98.24,9.67 98.24,15.75 92.2,15.75 92.2,13.7
VBOOST on Top Layer: 71.64,20.52 69.01,20.52 68.87,20.38 68.87,19.3 69.59,19.3 69.59,17.16 69.6,17.14 72.21,17.14 72.21,18.18 71.1,18.18 70.74,18.54 70.74,20.19 71.64,20.19
$1N16164 on Top Layer: 16.38,28.83 16.38,27.56 17.4,27.56 17.65,27.31 18.75,27.31 18.75,29.57 17.63,29.57 16.89,28.83
$1N16703 on Top Layer: 31.24,30.61 38.99,30.61 38.99,27.56 31.24,27.56
